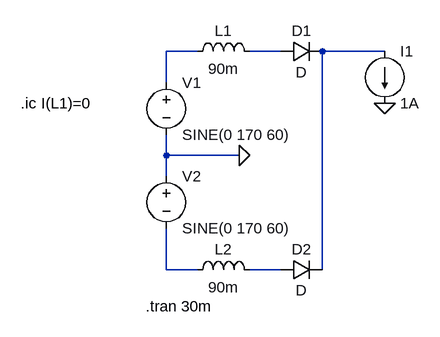
[diagram p0: schematic HW2q2.asc]
HW2q2.asc, the LTspice schematic file:
Version 4.1
SHEET 1 880 680
WIRE 64 -48 16 -48
WIRE 192 -48 144 -48
WIRE 352 -48 256 -48
WIRE 16 0 16 -48
WIRE 16 112 16 80
WIRE 128 112 16 112
WIRE 16 144 16 112
WIRE 16 288 16 224
WIRE 64 288 16 288
WIRE 192 288 144 288
WIRE 256 288 256 -48
FLAG 352 32 0
FLAG 128 112 0
SYMBOL voltage 16 -16 R0
WINDOW 123 0 0 Left 0
WINDOW 39 0 0 Left 0
SYMATTR InstName V1
SYMATTR Value SINE(0 170 60)
SYMBOL voltage 16 128 R0
WINDOW 123 0 0 Left 0
WINDOW 39 0 0 Left 0
SYMATTR InstName V2
SYMATTR Value SINE(0 170 60)
SYMBOL ind 48 -32 R270
WINDOW 0 32 56 VTop 2
WINDOW 3 5 56 VBottom 2
SYMATTR InstName L1
SYMATTR Value 90m
SYMBOL ind 48 304 R270
WINDOW 0 32 56 VTop 2
WINDOW 3 5 56 VBottom 2
SYMATTR InstName L2
SYMATTR Value 90m
SYMBOL diode 192 -32 R270
WINDOW 0 32 32 VTop 2
WINDOW 3 0 32 VBottom 2
SYMATTR InstName D1
SYMBOL diode 192 304 R270
WINDOW 0 32 32 VTop 2
WINDOW 3 0 32 VBottom 2
SYMATTR InstName D2
SYMBOL current 352 -48 R0
WINDOW 123 0 0 Left 0
WINDOW 39 0 0 Left 0
SYMATTR InstName I1
SYMATTR Value 1A
TEXT -16 344 Left 2 !.tran 30m
TEXT -208 32 Left 2 !.ic I(L1)=0

The netlist it stands for:
* HW2q2.asc
V1 N001 0 SINE(0 170 60)
V2 0 N004 SINE(0 170 60)
L1 N001 N002 90m
L2 N004 N005 90m
D1 N002 N003 D
D2 N005 N003 D
I1 N003 0 1A
.model D D
.lib standard.dio
.tran 30m
.ic I(L1)=0
.backanno
.end